# Altium schematic sheet Schematic_photodiode_1.SchDoc
size A3; SheetNumber: 1; SheetTotal: 1
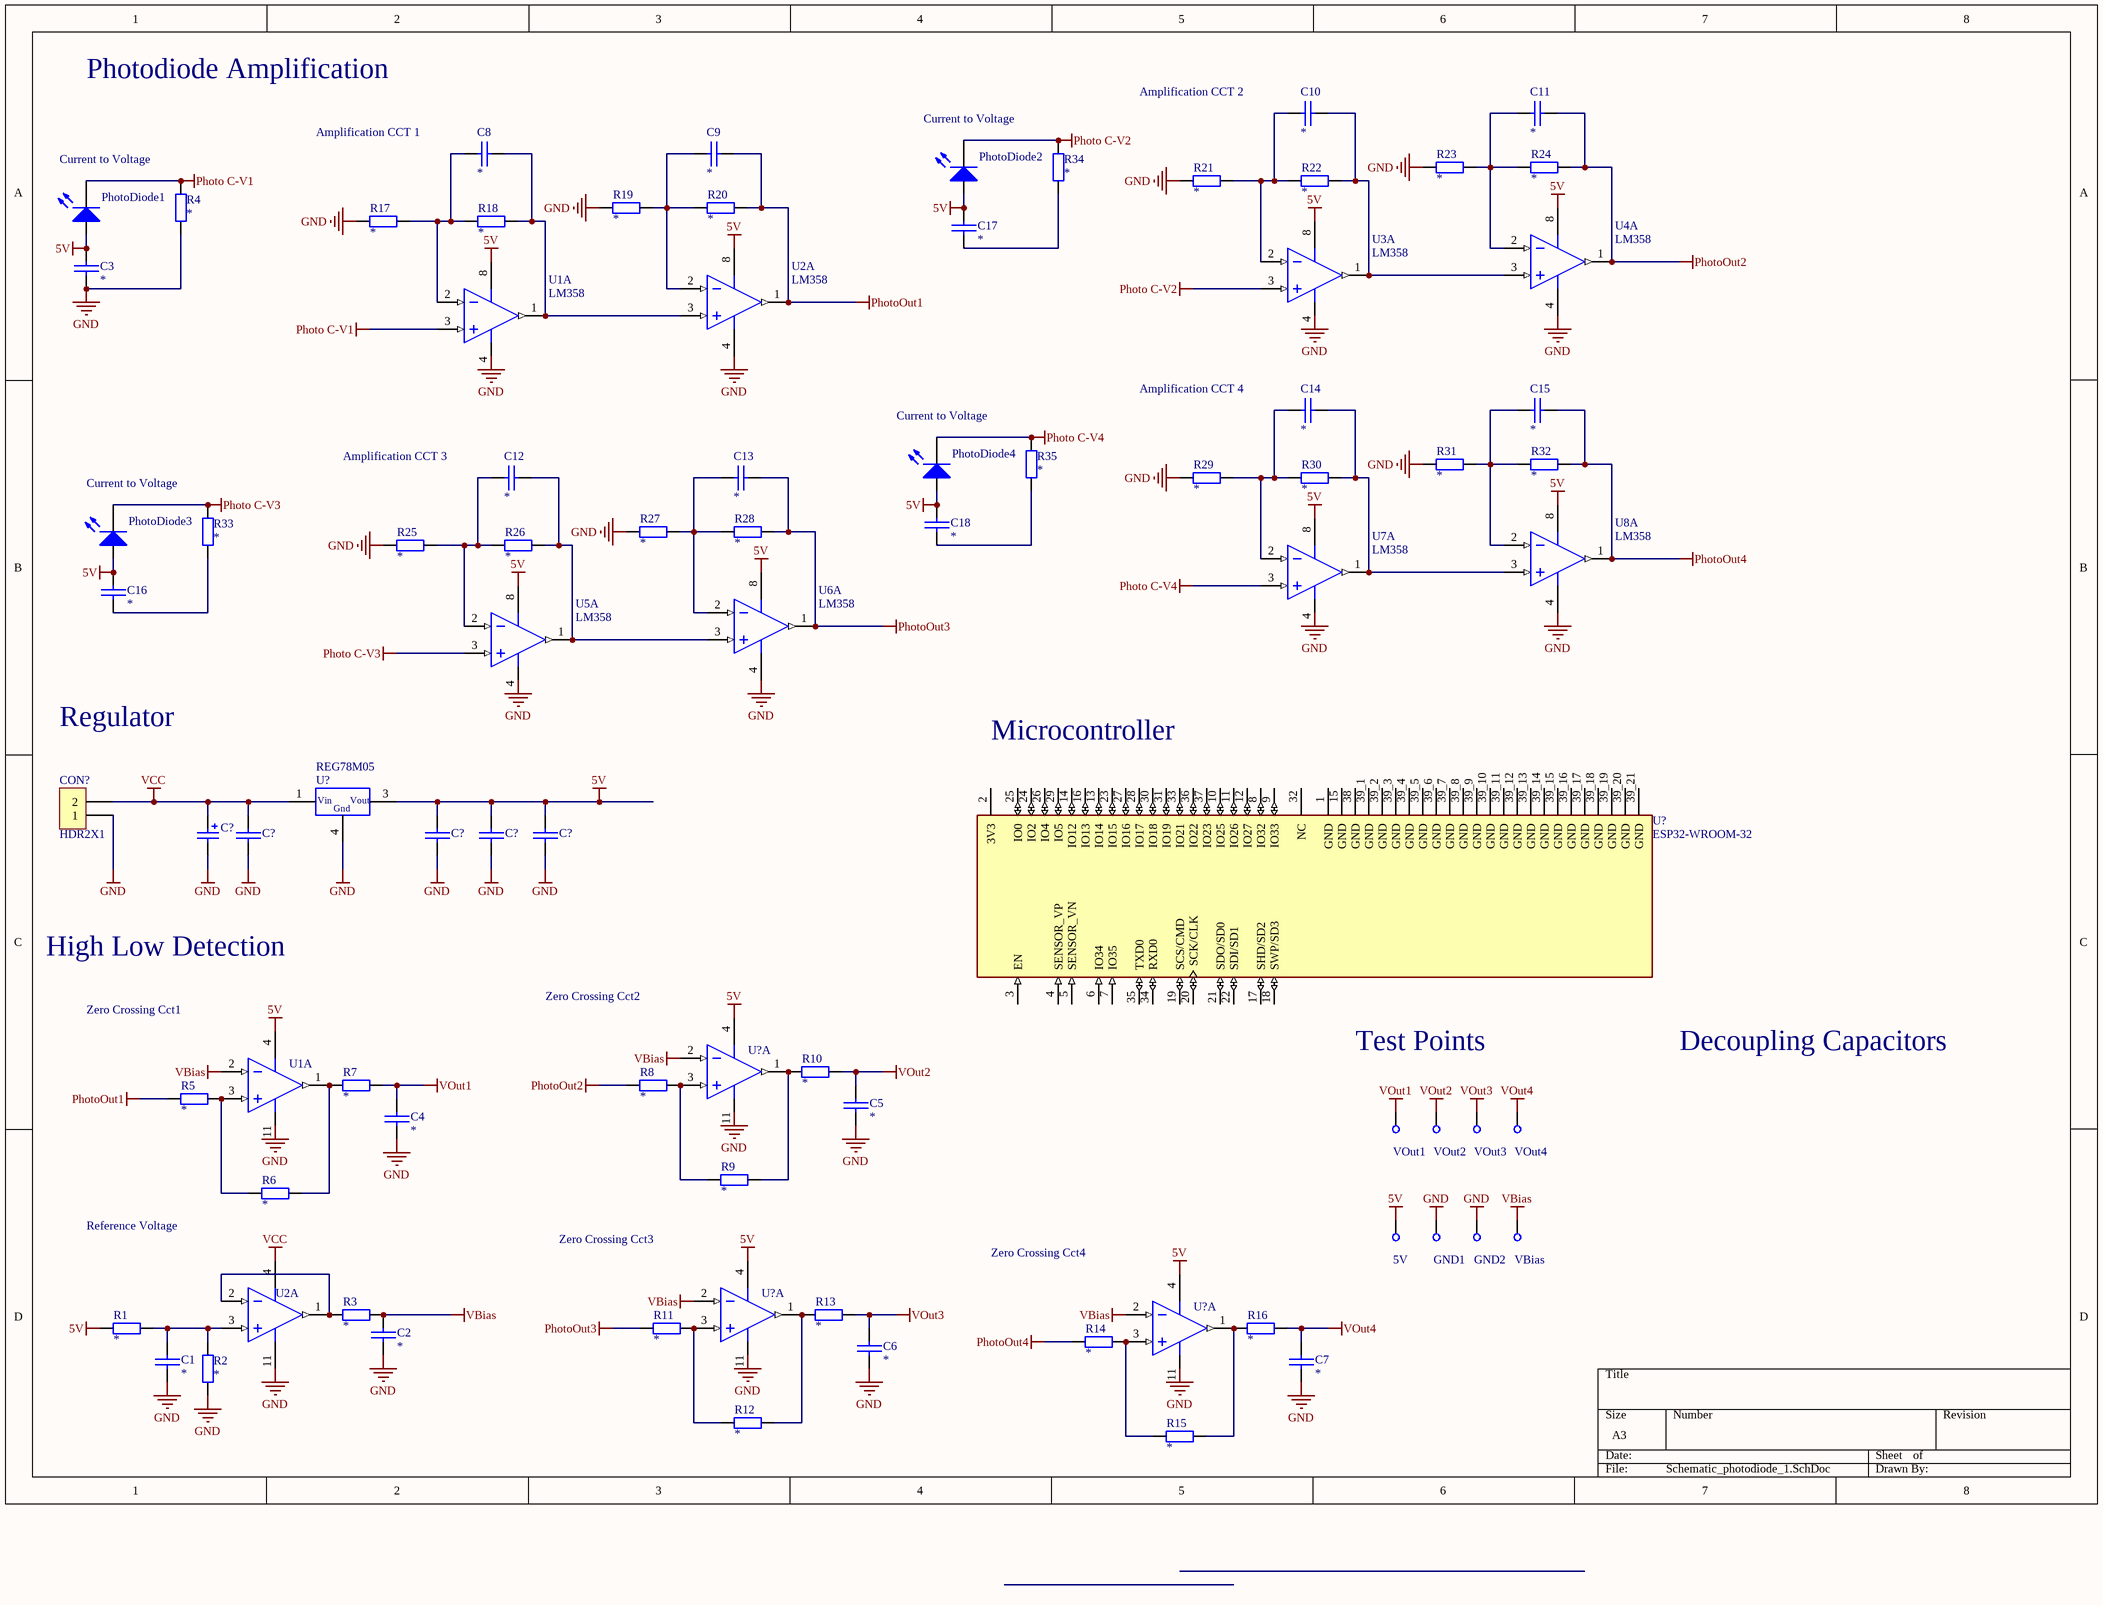
[diagram p0: Schematic_photodiode_1.SchDoc]

## Parts
(Parts that share a designator on the sheet are numbered #1, #2 ... from top to bottom, then left to right.)
5V  TP TH  [TP_TH_2.5mm]  (value not drawn)
C1  *  [CCAP-5P0]
C2  *  [CCAP-5P0]
C3  *  [CCAP-5P0]
C4  *  [CCAP-5P0]
C5  *  [CCAP-5P0]
C6  *  [CCAP-5P0]
C7  *  [CCAP-5P0]
C8  *  [FILM CAP-0.2]
C9  *  [FILM CAP-0.2]
C10  *  [FILM CAP-0.2]
C11  *  [FILM CAP-0.2]
C12  *  [FILM CAP-0.2]
C13  *  [FILM CAP-0.2]
C14  *  [FILM CAP-0.2]
C15  *  [FILM CAP-0.2]
C16  *  [CCAP-5P0]
C17  *  [CCAP-5P0]
C18  *  [CCAP-5P0]
C?#1  ECAP  [CR05]  (value not drawn)
C?#2  CCAP_TH_5P0  [CCAP_5P0]  (value not drawn)
C?#3  CCAP_TH_5P0  [CCAP_5P0]  (value not drawn)
C?#4  CCAP_TH_5P0  [CCAP_5P0]  (value not drawn)
C?#5  CCAP_TH_5P0  [CCAP_5P0]  (value not drawn)
CON?  HDR2X1  [HDR2X1_2P54]
GND1  TP TH  [TP_TH_2.5mm]  (value not drawn)
GND2  TP TH  [TP_TH_2.5mm]  (value not drawn)
PhotoDiode1  (no value)  [LED]
PhotoDiode2  (no value)  [LED]
PhotoDiode3  (no value)  [LED]
PhotoDiode4  (no value)  [LED]
R1  *  [AXIAL-0.4]
R2  *  [AXIAL-0.4]
R3  *  [AXIAL-0.4]
R4  *  [AXIAL-0.4]
R5  *  [AXIAL-0.4]
R6  *  [AXIAL-0.4]
R7  *  [AXIAL-0.4]
R8  *  [AXIAL-0.4]
R9  *  [AXIAL-0.4]
R10  *  [AXIAL-0.4]
R11  *  [AXIAL-0.4]
R12  *  [AXIAL-0.4]
R13  *  [AXIAL-0.4]
R14  *  [AXIAL-0.4]
R15  *  [AXIAL-0.4]
R16  *  [AXIAL-0.4]
R17  *  [AXIAL-0.4]
R18  *  [AXIAL-0.4]
R19  *  [AXIAL-0.4]
R20  *  [AXIAL-0.4]
R21  *  [AXIAL-0.4]
R22  *  [AXIAL-0.4]
R23  *  [AXIAL-0.4]
R24  *  [AXIAL-0.4]
R25  *  [AXIAL-0.4]
R26  *  [AXIAL-0.4]
R27  *  [AXIAL-0.4]
R28  *  [AXIAL-0.4]
R29  *  [AXIAL-0.4]
R30  *  [AXIAL-0.4]
R31  *  [AXIAL-0.4]
R32  *  [AXIAL-0.4]
R33  *  [AXIAL-0.4]
R34  *  [AXIAL-0.4]
R35  *  [AXIAL-0.4]
U1#1  LM358  [DIP-8]  (part A of 2)
U1#2  LM324  [DIP-14]  (value not drawn)  (part A of 4)
U2#1  LM358  [DIP-8]  (part A of 2)
U2#2  LM324  [DIP-14]  (value not drawn)  (part A of 4)
U3  LM358  [DIP-8]  (part A of 2)
U4  LM358  [DIP-8]  (part A of 2)
U5  LM358  [DIP-8]  (part A of 2)
U6  LM358  [DIP-8]  (part A of 2)
U7  LM358  [DIP-8]  (part A of 2)
U8  LM358  [DIP-8]  (part A of 2)
U?#1  REG78M05  [TO220_Reg]
U?#2  ESP32-WROOM-32  [MODULE_ESP32-WROOM-32]
U?#3  LM324  [DIP-14]  (value not drawn)  (part A of 4)
U?#4  LM324  [DIP-14]  (value not drawn)  (part A of 4)
U?#5  LM324  [DIP-14]  (value not drawn)  (part A of 4)
VBias  TP TH  [TP_TH_2.5mm]  (value not drawn)
VOut1  TP TH  [TP_TH_2.5mm]  (value not drawn)
VOut2  TP TH  [TP_TH_2.5mm]  (value not drawn)
VOut3  TP TH  [TP_TH_2.5mm]  (value not drawn)
VOut4  TP TH  [TP_TH_2.5mm]  (value not drawn)

## Nets
5V: 5V.1 C3.1 C16.1 C17.1 C18.1 C?#3.2 C?#4.2 C?#5.2 PhotoDiode1.1(A) PhotoDiode2.1(A) PhotoDiode3.1(A) PhotoDiode4.1(A) R1.1 U1#1.8(VDD) U1#2.4(VDD) U2#1.8(VDD) U3.8(VDD) U4.8(VDD) U5.8(VDD) U6.8(VDD) U7.8(VDD) U8.8(VDD) U?#1.3(Vout) U?#3.4(VDD) U?#4.4(VDD) U?#5.4(VDD)
GND: C1.2 C2.2 C3.2 C4.2 C5.2 C6.2 C7.2 C?#1.2 C?#2.1 C?#3.1 C?#4.1 C?#5.1 CON?.1 GND1.1 GND2.1 R2.1 R4.1 R17.1 R19.1 R21.1 R23.1 R25.1 R27.1 R29.1 R31.1 U2#1.4(VSS) U2#2.11(VSS) U4.4(VSS) U6.4(VSS) U8.4(VSS) U?#1.4(Gnd)
Photo C-V1: PhotoDiode1.2(K) R4.2 U1#1.3(VINA+)
Photo C-V2: PhotoDiode2.2(K) R34.2 U3.3(VINA+)
Photo C-V3: PhotoDiode3.2(K) R33.2 U5.3(VINA+)
Photo C-V4: PhotoDiode4.2(K) R35.2 U7.3(VINA+)
PhotoOut1: C9.2 R5.1 R20.2 U2#1.1(VOUTA)
PhotoOut2: C11.2 R8.1 R24.2 U4.1(VOUTA)
PhotoOut3: C13.2 R11.1 R28.2 U6.1(VOUTA)
PhotoOut4: C15.2 R14.1 R32.2 U8.1(VOUTA)
VBias: C2.1 R3.2 U1#2.2(VINA-) U?#3.2(VINA-) U?#4.2(VINA-) U?#5.2(VINA-) VBias.1
VCC: C?#1.1 C?#2.2 CON?.2 U2#2.4(VDD) U?#1.1(Vin)
VOut1: C4.1 R7.2 VOut1.1
VOut2: C5.1 R10.2 VOut2.1
VOut3: C6.1 R13.2 VOut3.1
VOut4: C7.1 R16.2 VOut4.1
NetC1_1: C1.1 R1.2 R2.2 U2#2.3(VINA+)
NetC8_1: C8.1 R17.2 R18.1 U1#1.2(VINA-)
NetC8_2: C8.2 R18.2 U1#1.1(VOUTA) U2#1.3(VINA+)
NetC9_1: C9.1 R19.2 R20.1 U2#1.2(VINA-)
NetC10_1: C10.1 R21.2 R22.1 U3.2(VINA-)
NetC10_2: C10.2 R22.2 U3.1(VOUTA) U4.3(VINA+)
NetC11_1: C11.1 R23.2 R24.1 U4.2(VINA-)
NetC12_1: C12.1 R25.2 R26.1 U5.2(VINA-)
NetC12_2: C12.2 R26.2 U5.1(VOUTA) U6.3(VINA+)
NetC13_1: C13.1 R27.2 R28.1 U6.2(VINA-)
NetC14_1: C14.1 R29.2 R30.1 U7.2(VINA-)
NetC14_2: C14.2 R30.2 U7.1(VOUTA) U8.3(VINA+)
NetC15_1: C15.1 R31.2 R32.1 U8.2(VINA-)
NetC16_2: C16.2 R33.1
NetC17_2: C17.2 R34.1
NetC18_2: C18.2 R35.1
NetR3_1: R3.1 U2#2.1(VOUTA) U2#2.2(VINA-)
NetR5_2: R5.2 R6.1 U1#2.3(VINA+)
NetR6_2: R6.2 R7.1 U1#2.1(VOUTA)
NetR8_2: R8.2 R9.1 U?#3.3(VINA+)
NetR9_2: R9.2 R10.1 U?#3.1(VOUTA)
NetR11_2: R11.2 R12.1 U?#4.3(VINA+)
NetR12_2: R12.2 R13.1 U?#4.1(VOUTA)
NetR14_2: R14.2 R15.1 U?#5.3(VINA+)
NetR15_2: R15.2 R16.1 U?#5.1(VOUTA)

Not connected (* = marked no-connect by the designer): U1#1 4(VSS); U1#2 11(VSS); U3 4(VSS); U5 4(VSS); U7 4(VSS); U?#2 1(GND) 2(3V3) 3(EN) 4(SENSOR_VP) 5(SENSOR_VN) 6(IO34) 7(IO35) 8(IO32) 9(IO33) 10(IO25) 11(IO26) 12(IO27) 13(IO14) 14(IO12) 15(GND) 16(IO13) 17(SHD/SD2) 18(SWP/SD3) 19(SCS/CMD) 20(SCK/CLK) 21(SDO/SD0) 22(SDI/SD1) 23(IO15) 24(IO2) 25(IO0) 26(IO4) 27(IO16) 28(IO17) 29(IO5) 30(IO18) 31(IO19) 32(NC) 33(IO21) 34(RXD0) 35(TXD0) 36(IO22) 37(IO23) 38(GND) 39_1(GND) 39_2(GND) 39_3(GND) 39_4(GND) 39_5(GND) 39_6(GND) 39_7(GND) 39_8(GND) 39_9(GND) 39_10(GND) 39_11(GND) 39_12(GND) 39_13(GND) 39_14(GND) 39_15(GND) 39_16(GND) 39_17(GND) 39_18(GND) 39_19(GND) 39_20(GND) 39_21(GND); U?#3 11(VSS); U?#4 11(VSS); U?#5 11(VSS)

## Notes on the sheet
- Photodiode Amplification
- (near C10) Amplification CCT 2
- Current to Voltage
- (near C8) Amplification CCT 1
- (near C14) Amplification CCT 4
- (near C12) Amplification CCT 3
- Regulator
- Microcontroller
- High Low Detection
- Zero Crossing Cct1
- Zero Crossing Cct2
- Test Points
- Decoupling Capacitors
- Reference Voltage
- Zero Crossing Cct3
- Zero Crossing Cct4
- Labels drawn without touching a wire or pin: GND

## Library data of the parts
5V GND1 GND2 VBias VOut1-VOut4 = CMP-046-000000-3: Testpoint through hole / Keystone compact / 5000 - Red / 5001 - Black / 5002 - White / 5003 - Orange / 5004 - Yellow; Source: UoAPE_Connectors and Mechanical.SchLib; Design Item ID: TP TH
C1-C7 C16-C18 = CerCap_TH_5P0: TH ceramic capacitor with 5mm pitch; Value: *
C8-C15 = FilmCap_TH_5P08: Throughhole film capacitor with 5.08mm pitch; Value: *
C?#1 = CMP-003-000000-2: Source: CommonSymbols_V1.SchLib; Design Item ID: ECAP
C?#2-C?#5 = CMP-001-00023-1: TH ceramic cap with 5mm pitch; Design Item ID: CCAP_5P0
CON? = CMP-004-000000-7: Header 2X1; Design Item ID: HDR2X1; Source: CommonSymbols_V1.SchLib
PhotoDiode1-PhotoDiode4 = LED_TH_2P54: Typical throughole GaAs LED with 2.54mm pitch; Manufacturer: Generic Components; Class I: Optoelectronic; Value: Green; Published: 8-Jun-2000; Revision: July-2002: Re-released for DXP Platform.; Publisher: Altium Limited; Class II: LED
R1-R35 = Res_TH_0AX4: Through hole resistor; Published: 8-Jun-2000; LatestRevisionDate: 17-Jul-2002; LatestRevisionNote: Re-released for DXP Platform.; PackageReference: AXIAL-0.4; Publisher: Altium Limited; Value: *; ComponentLink1Description: http://www.royalohm.com/pdf/product2017/PrecisionMetalMF.pdf
U1#1 U2#1 U3-U8 = LM358_TH_DIP8: IC OPAMP DIP; ComponentLink1URL: http://www.ti.com/lit/ds/symlink/tlc080a.pdf; ComponentLink1Description: http://www.ti.com/lit/ds/symlink/tlc080a.pdf; Supplier 1: Avnet; Supplier Part Number 1: LM358N
U1#2 U2#2 U?#3-U?#5 = LM324N_TH_DIP16: IC OPAMP GP 14DIP; Manufacturer: ON Semiconductor; Manufacturer Part Number: LM324N; Amplifier Type: General Purpose; Current - Supply: 1mA; Voltage - Supply, Single/Dual (±): 3 V ~ 32 V, ±1.5 V ~ 16 V; Supplier 1: Digi-Key; RoHS: RoHS Compliant; Category: Integrated Circuits (ICs); Stock 1: 2900; Pricing 1: 1=0.9, 10=0.775, 100=0.5789, 500=0.45482, 1000=0.35145 (NZD); Packaging: Tube; Part Status: Active; Output Type: -; Slew Rate: -; Operating Temperature: 0°C ~ 70°C; Mounting Type: Through Hole; Package / Case: 14-DIP (0.300", 7.62mm); Supplier Device Package: 14-DIP; Base Part Number: LM324; ComponentLink1URL: https://www.fairchildsemi.com/datasheets/LM/LM2902.pdf; ComponentLink1Description: https://www.fairchildsemi.com/datasheets/LM/LM2902.pdf; Supplier Part Number 1: LM324NFS-ND
U?#1 = CMP-011-000018-2: 78M Series Linear Regulators; Source: CommonSymbols_V1.SchLib; Design Item ID: REG78MXX
U?#2 = ESP32-WROOM-32: Bluetooth, WiFi 802.11b/g/n, Bluetooth v4.2 +EDR, Class 1, 2 and 3 Transceiver Module 2.4GHz ~ 2.5GHz Antenna Not Included, U.FL Surface Mount; MF: Espressif Systems; Price: None; Availability: In Stock; MP: ESP32-WROOM-32; Package: Module Espressif Systems; SnapEDA_Link: https://www.snapeda.com/parts/ESP32-WROOM-32/Espressif+Systems/view-part/?ref=snap; Check_prices: https://www.snapeda.com/parts/ESP32-WROOM-32/Espressif+Systems/view-part/?ref=eda; Value: *; Purchase-URL: https://pricing.snapeda.com/search/part/ESP32-WROOM-32/?ref=eda